# EAGLE design MC3446(E7) (EAGLE 7.7.0)
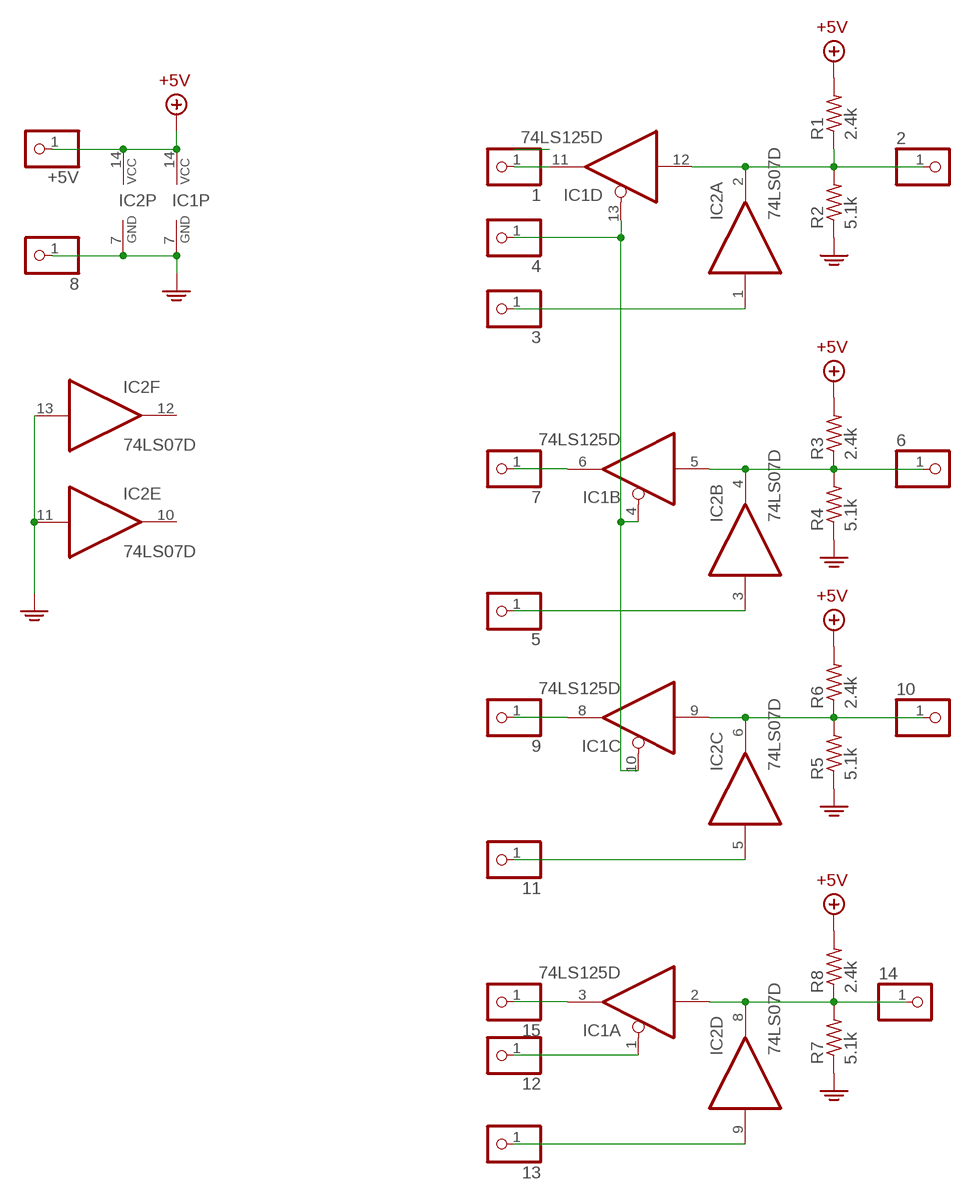
[diagram p0: schematic, sheet 1]

## Parts
1  PINHD-1X1  [1X01]
2  PINHD-1X1  [1X01]
3  PINHD-1X1  [1X01]
4  PINHD-1X1  [1X01]
5  PINHD-1X1  [1X01]
6  PINHD-1X1  [1X01]
7  PINHD-1X1  [1X01]
8  PINHD-1X1  [1X01]
9  PINHD-1X1  [1X01]
10  PINHD-1X1  [1X01]
11  PINHD-1X1  [1X01]
12  PINHD-1X1  [1X01]
13  PINHD-1X1  [1X01]
14  PINHD-1X1  [1X01]
15  PINHD-1X1  [1X01]
+5V  PINHD-1X1  [1X01]
IC1  74LS125D  [SO14]
IC2  74LS07D  [SO14]
R1  2.4k  R-US_R0805  [R0805]
R2  5.1k  R-US_R0805  [R0805]
R3  2.4k  R-US_R0805  [R0805]
R4  5.1k  R-US_R0805  [R0805]
R5  5.1k  R-US_R0805  [R0805]
R6  2.4k  R-US_R0805  [R0805]
R7  5.1k  R-US_R0805  [R0805]
R8  2.4k  R-US_R0805  [R0805]

## Nets
+5V: +5V.1 IC1.14(P:VCC) IC2.14(P:VCC) R1.2 R3.2 R6.2 R8.2
GND: 8.1 IC1.7(P:GND) IC2.7(P:GND) IC2.11(E:I) IC2.13(F:I) R2.1 R4.1 R5.1 R7.1
N$1: 2.1 IC1.12(D:I) IC2.2(A:O) R1.1 R2.2
N$2: 3.1 IC2.1(A:I)
N$3: 1.1 IC1.11(D:O)
N$4: 4.1 IC1.4(B:OE) IC1.10(C:OE) IC1.13(D:OE)
N$5: 6.1 IC1.5(B:I) IC2.4(B:O) R3.1 R4.2
N$6: 10.1 IC1.9(C:I) IC2.6(C:O) R5.2 R6.1
N$7: 14.1 IC1.2(A:I) IC2.8(D:O) R7.2 R8.1
N$8: 7.1 IC1.6(B:O)
N$9: 5.1 IC2.3(B:I)
N$10: 9.1 IC1.8(C:O)
N$11: 15.1 IC1.3(A:O)
N$12: 11.1 IC2.5(C:I)
N$13: 13.1 IC2.9(D:I)
N$14: 12.1 IC1.1(A:OE)
Unconnected: IC2.10(E:O) IC2.12(F:O)

## Library data of the parts
1-15 +5V = pinhead:PINHD-1X1: PIN HEADER
IC1 = 74xx-eu:74*125: Quad bus BUFFER, 3-state
IC2 = 74xx-eu:74*07: Hex BUFFER, open collector high-voltage output
R1-R8 = rcl:R-US_: RESISTOR, American symbol

## Board
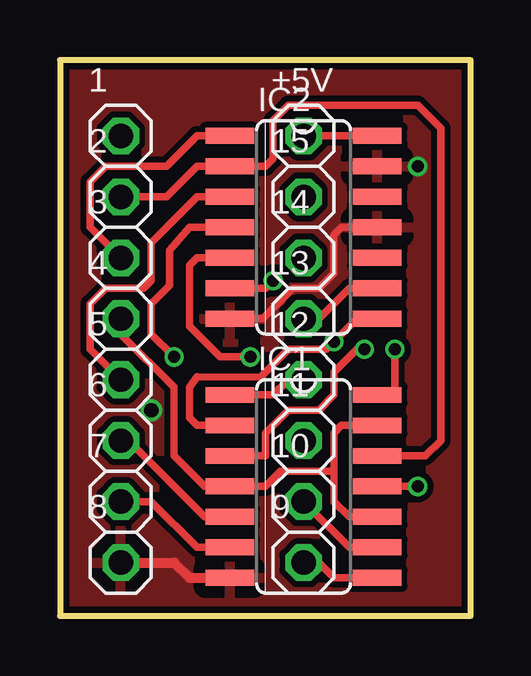
[diagram p1: board, top side]
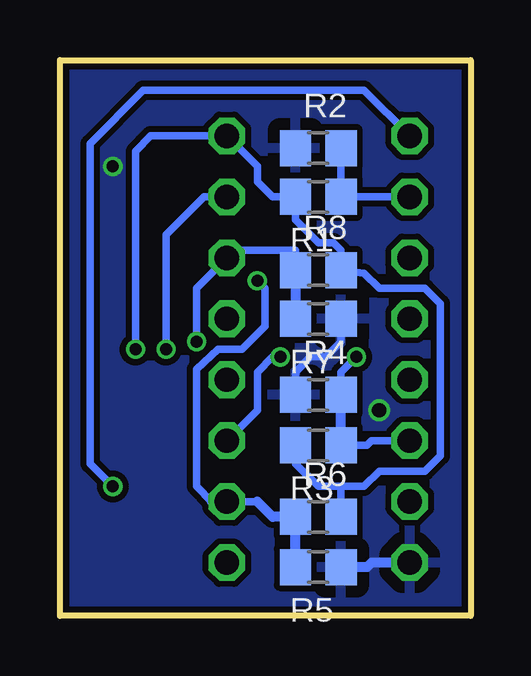
[diagram p2: board, bottom side, seen from below]

Size 17.12 x 23.16 mm. Coordinates in mm from the lower left corner, seen from the top.
Outline: 0,0 17.12,0 17.12,23.16 0,23.16 0,0
Copper layers (1*16): Top 0.035mm / dielectric 1.5mm / Bottom 0.035mm
Design rules "Kens Modified_SeeedStudio_2layer_DRU_no_angle": minimum track width 6mil, minimum drill 12mil, track to track 10mil, track to pad 10mil, pad to pad 10mil, via to via 10mil, smd to smd 0mil, copper to edge 10mil, drill to drill 10mil, minimum pad ring 10mil, minimum via ring 6mil, stop-mask expansion 2mil, vias tented up to drill 100mil, thermal gap 20mil

### Footprints (pad centres in the part's own frame; a part is rotated, then mirrored left to right if it is on the bottom)
1X01 = drill 1.016 octagon: 1 0,0
SO14 = smd 0.66 x 2.032: 1 -3.81,-3.073; 2 -2.54,-3.073; 3 -1.27,-3.073; 4 0,-3.073; 5 1.27,-3.073; 6 2.54,-3.073; 7 3.81,-3.073; 8 3.81,3.073; 9 2.54,3.073; 10 1.27,3.073; 11 0,3.073; 12 -1.27,3.073; 13 -2.54,3.073; 14 -3.81,3.073
R0805 = smd 1.3 x 1.5: 1 -0.95,0; 2 0.95,0

### Placement (x,y rotation side)
1  2.54,20 0 top
2  2.54,17.46 0 top
3  2.54,14.92 0 top
4  2.54,12.38 0 top
5  2.54,9.84 0 top
6  2.54,7.3 0 top
7  2.54,4.76 0 top
8  2.54,2.22 0 top
9  10.16,2.22 0 top
10  10.16,4.76 0 top
11  10.16,7.3 0 top
12  10.16,9.84 0 top
13  10.16,12.38 0 top
14  10.16,14.92 0 top
15  10.16,17.46 0 top
+5V  10.16,20 0 top
IC1  10.16,5.4 270 top
IC2  10.16,16.19 270 top
R1  6.35,17.46 180 bottom
R2  6.35,19.49 0 bottom
R3  6.35,7.11 180 bottom
R4  6.35,9.21 0 bottom
R5  6.35,2.03 180 bottom
R6  6.35,4.13 0 bottom
R7  6.35,12.38 180 bottom
R8  6.35,14.41 0 bottom

### Tracks (layer width: path | path; a pad name or v marks a point on that pad's centre or on a via)
+5V  (via drill 0.5)
  Top 0.305: +5V.1 IC2.14 | v13.97,11.11 13.97,9.21
  Top 0.406: 13.97,9.21 IC1.14
  Bottom 0.305: +5V.1 8.89,18.73 8.89,18.1 8.26,17.46 R1.2 7.3,16.51 6.35,15.56 5.71,15.56 5.4,15.24 R8.2 4.45,14.29 3.81,13.65 1.91,13.65 1.27,13.02 1.27,6.67 1.91,6.03 3.81,6.03 4.45,5.4 5.08,5.4 5.4,5.39 | 5.4,5.39 R6.2 | R3.2 7.3,6.35 6.35,5.4 5.72,5.4 5.4,5.39 | 10.38,20 13.34,20 13.97,19.37 v13.97,11.11
  Bottom 0.406: +5V.1 10.38,20
GND  (via drill 0.5, 0.6)
  Top 0.305: IC2.7 8.45,12.38 9.72,13.65 10.79,13.65 11.43,14.29 11.43,15.88 11.75,16.19 IC2.11
  Top 0.406: IC1.7 5.4,1.59 4.76,2.22 8.1
  Bottom 0.305: R4.1 7.3,10.16 6.67,10.79 6.03,10.79 5.4,11.43 R7.1
  Bottom 0.406: 8.1 4.13,2.22 4.32,2.03 R5.1
  other vias: 3.81,8.57 14.92,18.73
  pour Top: 0.32,22.86 16.83,22.86 16.83,-0.32 0.32,-0.32
  pour Bottom: 0.32,22.86 16.83,22.86 16.83,-0.32 0.32,-0.32
N$1
  Top 0.305: 2.1 4.45,17.46 5.71,18.73 IC2.2 8.57,18.73 8.89,19.05 8.89,20.64 9.53,21.27 14.92,21.27 15.88,20.32 15.88,7.3 15.24,6.67 IC1.12
  Bottom 0.305: 2.1 R1.1 R2.2
N$2
  Top 0.305: 3.1 1.27,16.19 1.27,18.1 1.91,18.73 4.45,18.73 5.71,20 IC2.1
N$3  (via drill 0.5)
  Top 0.305: IC1.11 v14.92,5.4
  Bottom 0.305: 1.1 4.45,21.91 13.65,21.91 15.88,19.68 15.88,6.35 v14.92,5.4
N$4
  Top 0.305: 4.1 2.54,11.75 4.76,9.53 4.76,6.67 6.03,5.4 IC1.4 8.57,5.4 9.21,6.03 11.43,6.03 | IC1.10 12.06,4.13 11.43,4.76 11.43,6.03 | IC1.13 11.75,7.94 11.43,7.62 11.43,6.03
N$5  (via drill 0.5)
  Top 0.305: IC1.5 6.03,4.13 2.86,7.3 6.1 | IC2.4 5.4,16.19 4.57,15.24 4.57,13.78 3.81,13.02 3.81,11.75 v4.76,10.79
  Bottom 0.305: 6.1 4.13,7.3 4.32,7.11 R3.1 | R4.2 5.4,10.16 v4.76,10.79
  Bottom 0.406: R3.1 R4.2
N$6  (via drill 0.5)
  Top 0.305: IC1.9 12.06,2.86 10.1 | v8.89,13.97 8.57,13.65 IC2.6
  Bottom 0.305: 8.89,4.76 10.1 | 10.79,4.76 11.43,5.4 11.43,10.29 10.54,11.11 9.53,11.11 8.57,12.06 8.57,13.65 v8.89,13.97
  Bottom 0.406: R5.2 R6.1 8.26,4.13 8.89,4.76 | 10.1 10.79,4.76
N$7  (via drill 0.5)
  Top 0.305: IC2.8 12.38,12.38 v11.43,11.43 11.11,11.11 9.53,11.11 8.36,9.94 5.71,9.97 5.4,9.53 5.4,8.26 5.71,7.94 IC1.2
  Bottom 0.305: R8.1 7.3,14.29 7.3,15.24 9.84,15.24 14.1 11.43,13.65 v11.43,11.43
  Bottom 0.406: R8.1 R7.2
N$8
  Top 0.305: IC1.6 5.71,2.86 3.81,4.76 7.1
N$9
  Top 0.305: 5.1 1.27,11.11 1.27,13.02 1.91,13.65 3.49,13.65 3.81,13.97 3.81,15.56 5.71,17.46 IC2.3
N$10
  Top 0.305: 9.1 10.79,2.22 11.43,1.59 IC1.8
N$11  (via drill 0.5)
  Top 0.305: 7.94,6.67 8.57,6.67 8.57,7.62 9.53,8.57 10.79,8.57 11.43,9.21 11.43,10.16 12.38,11.11 v12.7,11.11
  Top 0.406: IC1.3 7.94,6.67
  Bottom 0.305: v12.7,11.11 12.7,15.88 11.11,17.46 15.1
N$12  (via drill 0.5)
  Top 0.305: IC2.5 5.71,14.92 5.4,14.61 5.4,12.06 6.67,10.79 v7.94,10.79
  Bottom 0.305: 11.1 8.89,8.57 8.89,10.16 8.26,10.79 v7.94,10.79
N$13
  Top 0.305: 13.1 10.79,12.38 11.11,12.7 12.06,13.65 IC2.9
N$14
  Top 0.305: 12.1 9.53,9.84 8.89,9.21 IC1.1

### Text on the board
tValues: MC3446 | 1